# Altium schematic sheet usb.SchDoc: Наименование
size 209 x 297 mm; ApprovedBy: Утвердил; CheckedBy: Проверил; Author: Разработал; CompanyName: ВлГУ; DrawnBy: Н.Контр; Engineer: Т.Контр; SheetNumber: 1; SheetTotal: 1; PageSetup: Record=PageOptions|CenterHorizontal=True|CenterVertical=True|PrintScale=0.94|XCorrection=1.00|YCorrection=1.00|PrintKind=1|BorderSize=5000000|LeftOffset=0|BottomOffset=0|Orientation=1|PaperLength=1000|PaperWidth=1000|Scale=100|PaperSource=7|PrintQuality=-4|MediaType=1|DitherType=10|PaperKind=A4|PrintScaleMode=1; DecimalNumber: Децимальный номер; HeadOfSector: Нач. сектора; MainDevice: Перв.примен.; Name: Наименование; DocumentName: Sheet1.SCHDOC
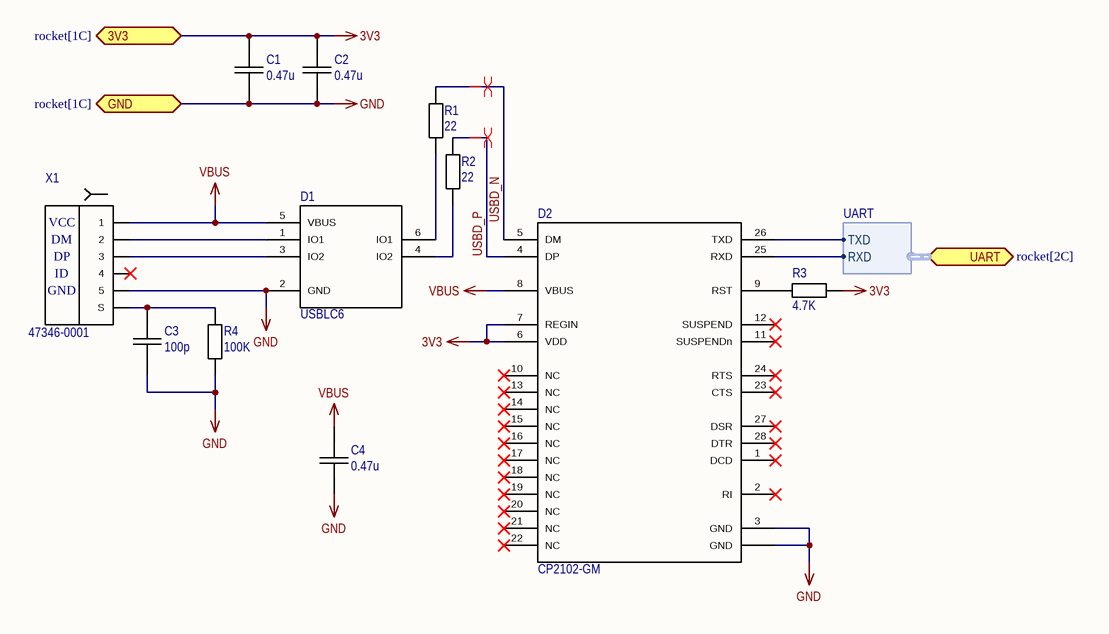
[diagram p0: usb.SchDoc]

## Parts
C1  value 0.47u  [CAP-0402]  (hidden comment: CAP-0.47u-10%-50V-X7R-0402)
C2  value 0.47u  [CAP-0402]  (hidden comment: CAP-0.47u-10%-50V-X7R-0402)
C3  value 100p  [CAP-0805]  (hidden comment: CAP-100p-10%-100V-COG-0805)
C4  value 0.47u  [CAP-0402]  (hidden comment: CAP-0.47u-10%-50V-X7R-0402)
D1  USBLC6  [SOT-23-6]
D2  CP2102-GM  [QFN-28-5x5]
R1  value 22  [RES-0402]  (hidden comment: RES-22-1%-0.063-0402)
R2  value 22  [RES-0402]  (hidden comment: RES-22-1%-0.063-0402)
R3  value 4.7K  [RES-0402]  (hidden comment: RES-4.7K-1%-0.063-0402)
R4  value 100K  [RES-0402]  (hidden comment: RES-100K-1%-0.063-0402)
X1  47346-0001  [473460001]

## Ports
3V3 (bidir, see rocket[1C]), GND (bidir, see rocket[1C]), UART (bidir, harness UART, see rocket[2C])

## Harnesses
UART: TXD, RXD

## Nets
3V3: C1.2 C2.2 D2.6(VDD) D2.7(REGIN) R3.1 ; port 3V3
GND: C1.1 C2.1 C3.1 C4.1 D1.2(GND) D2.3(GND) D2.PAD(GND) R4.1 X1.5 ; port GND
VBUS: C4.2 D1.5(VBUS) D2.8(VBUS) X1.1
USBD_N: D2.5(DM) R1.2
USBD_P: D2.4(DP) R2.2
NetC3_2: C3.2 R4.2 X1.SHIELD(S)
NetD1_1: D1.1(IO1) X1.2
NetD1_3: D1.3(IO2) X1.3
NetD1_4: D1.4(IO2) R2.1
NetD1_6: D1.6(IO1) R1.1
NetD2_9: D2.9(RST) R3.2
NetD2_25: D2.25(RXD) ; port UART.RXD
NetD2_26: D2.26(TXD) ; port UART.TXD

Not connected (* = marked no-connect by the designer): D2 1(DCD)* 2(RI)* 10(NC)* 11(SUSPENDn)* 12(SUSPEND)* 13(NC)* 14(NC)* 15(NC)* 16(NC)* 17(NC)* 18(NC)* 19(NC)* 20(NC)* 21(NC)* 22(NC)* 23(CTS)* 24(RTS)* 27(DSR)* 28(DTR)*; X1 4*

## Layout directives
differential pair: USBD_N, USBD_P

## Notes on the sheet
- Подп. и дата
- Инв.№ дубл.
- Взам.инв.№
- Подп.и дата
- Инв.№ подл.
- Изм.
- Лист
- № докум.
- Подп.
- Дата
- Формат  A4
- (in symbol USB-Micro-B) VCC; DM; DP; ID; GND

## Library data of the parts
C1 C2 C4 = CAP-0402: Конденсатор; Tolerance: 10; Voltage: 50; Part Number: *; Manufacturer: *; Temperature: X7R
C3 = CAP-0805: Конденсатор; Tolerance: 10; Voltage: 100; Part Number: *; Manufacturer: *; Temperature: COG
D1 = USBLC6: Интегральная микросхема; Manufacturer: TI; Part Number: USBLC6
D2 = CP2102: Интегральная микросхема; Manufacturer: SiLabs; Part Number: CP2102-GM
R1-R4 = RES-0402: Резистор; Tolerance: 1; Power: 0.063; Part Number: *; Manufacturer: *
X1 = USB-Micro-B: Manufacturer: Molex; Part Number: 47346-0001